# EAGLE design atmega16m1-breakout (EAGLE 8.3.2)
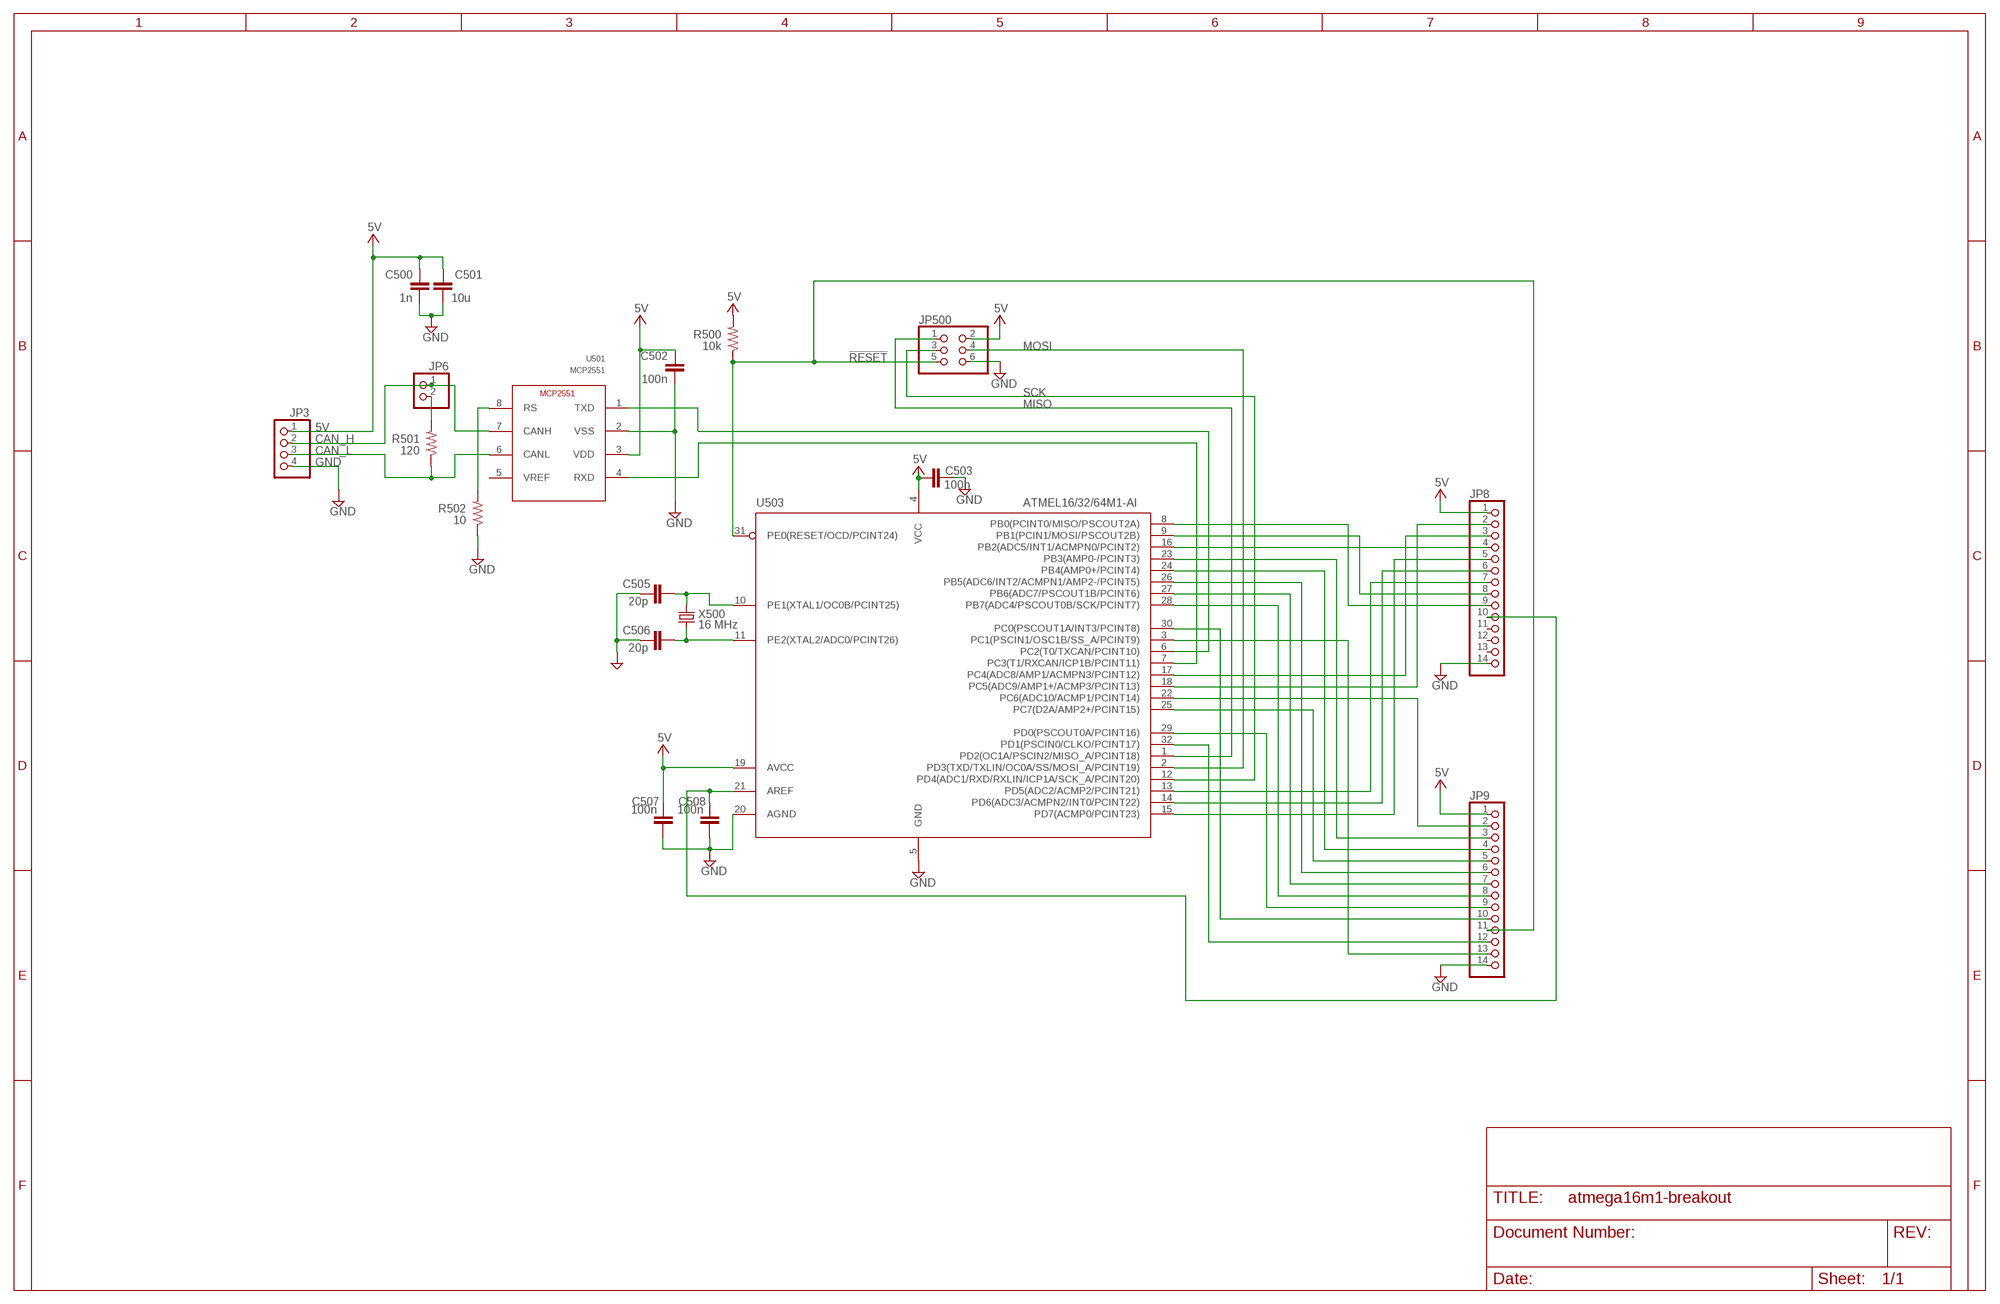
[diagram p0: schematic, sheet 1]
FRAME1 (FRAME_B_L): REV: 3

## Parts
C500  1n  C-EU0603-B-NOSILK  [0603-B-NOSILK]
C501  10u  C-EU0805-B-NOSILK  [0805-B-NOSILK]
C502  100n  C-EU0603-B-NOSILK  [0603-B-NOSILK]
C503  100n  C-EU0603-B-NOSILK  [0603-B-NOSILK]
C505  20p  C-EU0603-B-NOSILK  [0603-B-NOSILK]
C506  20p  C-EU0603-B-NOSILK  [0603-B-NOSILK]
C507  100n  C-EU0603-B-NOSILK  [0603-B-NOSILK]
C508  100n  C-EU0603-B-NOSILK  [0603-B-NOSILK]
JP3  PINHD-1X4  [1X04]
JP6  PINHD-1X2  [1X02]
JP8  PINHD-1X14  [1X14]
JP9  PINHD-1X14  [1X14]
JP500  PINHD-2X3  [2X03]
R500  10k  R-US_0603-B-NOSILK  [0603-B-NOSILK]
R501  120  R-US_0603-B-NOSILK  [0603-B-NOSILK]
R502  10  R-US_0603-B-NOSILK  [0603-B-NOSILK]
U501  MCP2551  [SO08]
U503  ATMEL16/32/64M1-AI  ATMEL16/32/64M1-AZ  [TQFP32-08]
X500  16 MHz  CRYSTALABM3  [ABM3]

## Nets
5V: C500.1 C501.1 C502.1 C503.2 C507.1 JP3.1 JP8.1 JP9.1 JP500.2 R500.2 U501.3(VDD) U503.4(VCC) U503.19(AVCC)
!RESET: JP9.11 JP500.5 R500.1 U503.31(PE0(RESET/OCD/PCINT24))
AREF: C508.1 JP8.10 U503.21(AREF)
CAN_H: JP3.2 JP6.1 U501.7(CANH)
CAN_L: JP3.3 R501.1 U501.6(CANL)
GND: C500.2 C501.2 C502.2 C503.1 C505.2 C506.2 C507.2 C508.2 JP3.4 JP8.14 JP9.14 JP500.6 R502.1 U501.2(VSS) U503.5(GND) U503.20(AGND)
MISO: JP500.1 U503.1(PD2(OC1A/PSCIN2/MISO_A/PCINT18))
MOSI: JP500.4 U503.2(PD3(TXD/TXLIN/OC0A/SS/MOSI_A/PCINT19))
N$3: JP6.2 R501.2
N$10: R502.2 U501.8(RS)
PB0: JP8.9 U503.8(PB0(PCINT0/MISO/PSCOUT2A))
PB1: JP8.8 U503.9(PB1(PCIN1/MOSI/PSCOUT2B))
PB2: JP8.4 U503.16(PB2(ADC5/INT1/ACMPN0/PCINT2))
PB3: JP9.3 U503.23(PB3(AMP0-/PCINT3))
PB4: JP9.4 U503.24(PB4(AMP0+/PCINT4))
PB5: JP9.6 U503.26(PB5(ADC6/INT2/ACMPN1/AMP2-/PCINT5))
PB6: JP9.7 U503.27(PB6(ADC7/PSCOUT1B/PCINT6))
PB7: JP9.8 U503.28(PB7(ADC4/PSCOUT0B/SCK/PCINT7))
PC0: JP9.10 U503.30(PC0(PSCOUT1A/INT3/PCINT8))
PC1: JP9.13 U503.3(PC1(PSCIN1/OSC1B/SS_A/PCINT9))
PC4: JP8.3 U503.17(PC4(ADC8/AMP1/ACMPN3/PCINT12))
PC5: JP8.2 U503.18(PC5(ADC9/AMP1+/ACMP3/PCINT13))
PC6: JP9.2 U503.22(PC6(ADC10/ACMP1/PCINT14))
PC7: JP9.5 U503.25(PC7(D2A/AMP2+/PCINT15))
PD0: JP9.9 U503.29(PD0(PSCOUT0A/PCINT16))
PD1: JP9.12 U503.32(PD1(PSCIN0/CLKO/PCINT17))
PD5: JP8.7 U503.13(PD5(ADC2/ACMP2/PCINT21))
PD6: JP8.6 U503.14(PD6(ADC3/ACMPN2/INT0/PCINT22))
PD7: JP8.5 U503.15(PD7(ACMP0/PCINT23))
PE2: C506.1 U503.11(PE2(XTAL2/ADC0/PCINT26)) X500.P1
PE3: C505.1 U503.10(PE1(XTAL1/OC0B/PCINT25)) X500.P2
RXCAN: U501.4(RXD) U503.7(PC3(T1/RXCAN/ICP1B/PCINT11))
SCK: JP500.3 U503.12(PD4(ADC1/RXD/RXLIN/ICP1A/SCK_A/PCINT20))
TXCAN: U501.1(TXD) U503.6(PC2(T0/TXCAN/PCINT10))
Unconnected: JP8.11 JP8.12 JP8.13 U501.5(VREF)

## Library data of the parts
C500-C503 C505-C508 = rcl_custom:C-EU: CAPACITOR, European symbol
JP3 = pinhead:PINHD-1X4: PIN HEADER
JP6 = pinhead:PINHD-1X2: PIN HEADER
JP8 JP9 = pinhead:PINHD-1X14: PIN HEADER
JP500 = pinhead:PINHD-2X3: PIN HEADER
R500-R502 = rcl_custom:R-US_: RESISTOR, American symbol
U501 = Tova:MCP2551
U503 = Tova:ATMEL16/32/64M1: MICROCONTROLLER 8 Kbytes FLASH, 1 kbytes SRAM, 512 bytes EEPROM, USART, 6-channel 10 bit ADC, 2-channel 8 bit ADC Pin compatible with Atmega48, ATMega88, ATMega168 Source: avr.lbr; MPN: ATMEGA8-16AU; OC_FARNELL: 9171371; OC_NEWARK: 73M8863
X500 = Tova:CRYSTAL: Crystals Various standard crystals. Proven footprints. Spark Fun Electronics SKU : COM-00534

## Board
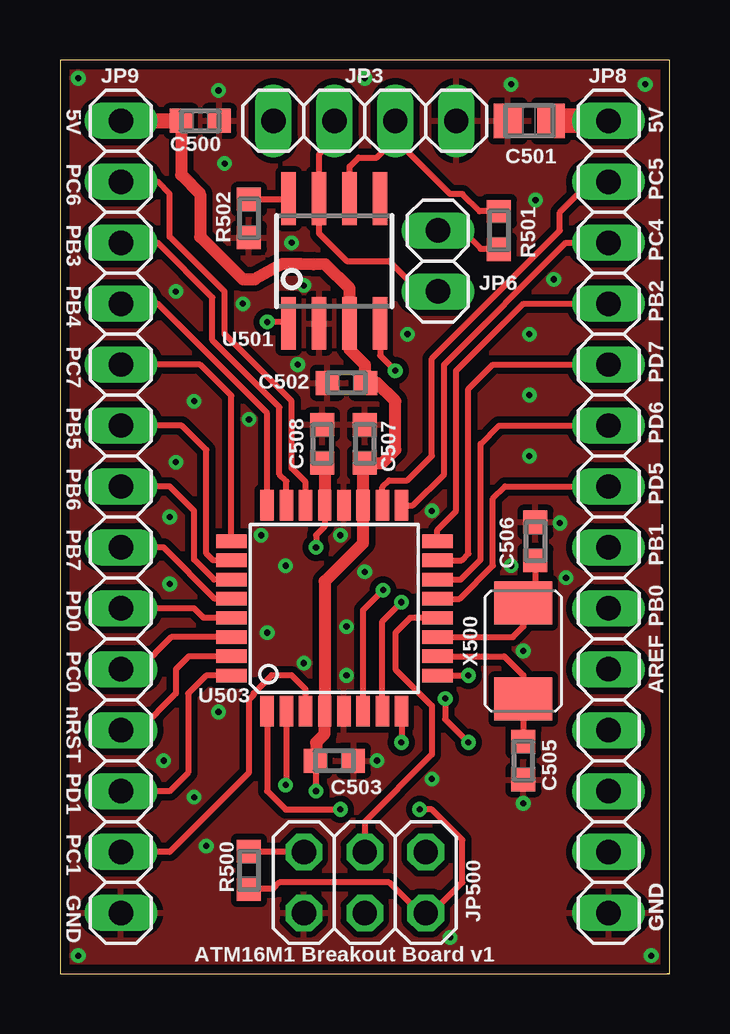
[diagram p1: board, top side]
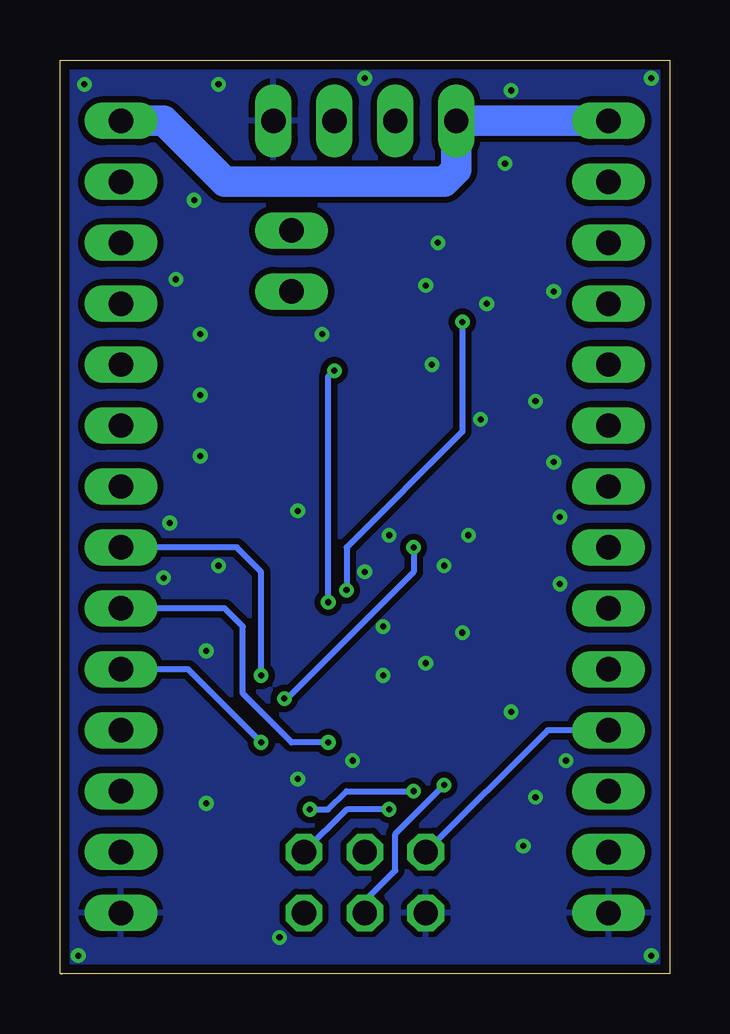
[diagram p2: board, bottom side, seen from below]

Size 25.4 x 38.1 mm. Coordinates in mm from the lower left corner, seen from the top.
Outline: 0,0 25.38,0 25.3,0 25.4,0 25.4,38.1 0,38.1 0,0
Copper layers (1*16): Top 0.0356mm / dielectric 1.5011mm / Bottom 0.0356mm
Design rules "OSH-Park-2-layer *": minimum track width 6mil, minimum drill 10mil, track to track 6mil, track to pad 6mil, pad to pad 6mil, via to via 6mil, smd to smd 6mil, copper to edge 15mil, drill to drill 6mil, minimum pad ring 7mil, minimum via ring 7mil, stop-mask expansion 3mil, vias tented up to drill 10mil, thermal gap 10mil

### Footprints (pad centres in the part's own frame; a part is rotated, then mirrored left to right if it is on the bottom)
0603-B-NOSILK = smd 0.95 x 1: 1 -0.8,0; 2 0.8,0
0805-B-NOSILK = smd 1.15 x 1.45: 1 -0.9,0; 2 0.9,0
1X04 = drill 1.016 long: 1 -3.81,0; 2 -1.27,0; 3 1.27,0; 4 3.81,0
1X02 = drill 1.016 long: 1 -1.27,0; 2 1.27,0
1X14 = drill 1.016 long: 1 -16.51,0; 2 -13.97,0; 3 -11.43,0; 4 -8.89,0; 5 -6.35,0; 6 -3.81,0; 7 -1.27,0; 8 1.27,0; 9 3.81,0; 10 6.35,0; 11 8.89,0; 12 11.43,0; 13 13.97,0; 14 16.51,0
2X03 = drill 1.016 octagon: 1 -2.54,-1.27; 2 -2.54,1.27; 3 0,-1.27; 4 0,1.27; 5 2.54,-1.27; 6 2.54,1.27
SO08 = smd 0.6 x 2.2: 1 -1.905,-2.6; 2 -0.635,-2.6; 3 0.635,-2.6; 4 1.905,-2.6; 5 1.905,2.6; 6 0.635,2.6; 7 -0.635,2.6; 8 -1.905,2.6
TQFP32-08 = smd 1.27 x 0.559: 1 -4.293,2.8; 2 -4.293,2; 3 -4.293,1.2; 4 -4.293,0.4; 5 -4.293,-0.4; 6 -4.293,-1.2; 7 -4.293,-2; 8 -4.293,-2.8; 17 4.293,-2.8; 18 4.293,-2; 19 4.293,-1.2; 20 4.293,-0.4; 21 4.293,0.4; 22 4.293,1.2; 23 4.293,2; 24 4.293,2.8 | smd 0.559 x 1.27: 9 -2.8,-4.293; 10 -2,-4.293; 11 -1.2,-4.293; 12 -0.4,-4.293; 13 0.4,-4.293; 14 1.2,-4.293; 15 2,-4.293; 16 2.8,-4.293; 25 2.8,4.293; 26 2,4.293; 27 1.2,4.293; 28 0.4,4.293; 29 -0.4,4.293; 30 -1.2,4.293; 31 -2,4.293; 32 -2.8,4.293
ABM3 = smd 1.8 x 2.4: P1 -2,0; P2 2,0

### Placement (x,y rotation side)
C500  5.84,35.56 0 top
C501  19.56,35.56 180 top
C502  11.94,24.64 180 top
C503  11.43,8.89 180 top
C505  19.3,8.89 270 top
C506  19.81,18.03 90 top
C507  12.7,22.1 90 top
C508  10.92,22.1 90 top
JP3  12.7,35.56 0 top
JP6  15.75,29.72 90 top
JP8  22.86,19.05 270 top
JP9  2.54,19.05 270 top
JP500  12.7,3.81 180 top
R500  7.87,4.32 270 top
R501  18.29,30.99 270 top
R502  7.87,31.5 90 top
U501  11.43,29.72 0 top
U503  11.43,15.24 90 top
X500  19.3,13.46 270 top

### Tracks (layer width: path | path; a pad name or v marks a point on that pad's centre or on a via)
5V  (via drill 0.25)
  Top 0.254: R500.2 7.91,3.56 8.89,3.56 9.14,3.81 13.72,3.81 14.99,2.54 JP500.2 15.49,2.54 16.76,3.81 16.76,5.59 15.49,6.86 v14.99,6.86 | v10.67,7.62 10.67,8.85 C503.2
  Top 0.508: C503.2 10.67,8.93 10.67,9.65 11.03,10.01 U503.4 11.03,16.36 12.63,17.96 U503.19 12.63,21.48 C507.1 13.42,21.3 13.97,21.84 13.97,23.88 13.21,24.64 C502.1 12.7,24.93 12.7,25.4 12.06,26.04 U501.3 12.06,28.57 11.06,29.58 10.55,29.58 10.03,29.6 9.28,29.6 8.12,28.96 7.62,28.96 5.84,30.73 5.84,32.51 5.04,33.31 C500.1
  Top 0.635: JP9.1 C500.1
  Top 1.016: C501.1 JP8.1
  Bottom 0.254: v14.99,6.86 14.22,6.86 13.46,7.62 v10.67,7.62
  Bottom 1.27: JP9.1 JP3.1 8.89,33.53 9.4,33.02 18.54,33.02 21.08,35.56 JP8.1
!RESET
  Top 0.254: JP500.5 7.91,5.08 R500.1 | U503.31 5.37,13.24 4.83,12.7 4.83,11.68 3.3,10.16 JP9.11
  Bottom 0.254: JP9.11 5.08,10.16 JP500.5
AREF  (via drill 0.25)
  Top 0.254: U503.21 11.03,18.65 10.67,18.29 v10.67,17.78 | v16.05,11.48 16.05,10.62 v17.02,9.65
  Top 0.508: U503.21 11.03,21.44 C508.1
  Bottom 0.254: v10.67,17.78 10.67,16.76 16,11.43 v16.05,11.48 | v17.02,9.65 20.07,12.7 JP8.10
CAN_H
  Top 0.254: JP6.1 14.99,28.45 13.72,29.72 11.94,29.72 10.79,30.86 U501.7 10.79,34.16 11.43,34.8 JP3.2
CAN_L
  Top 0.254: R501.1 17.49,31.79 16.76,32.51 16.26,32.51 13.97,34.8 | 13.97,34.8 JP3.3 | U501.6 12.06,33.66 12.45,34.04 13.21,34.04 13.97,34.8
GND  (via drill 0.25)
  other vias: 13.21,8.89 9.4,17.02 19.3,7.11 20.83,18.8 19.3,13.46 6.86,33.78 9.65,30.48 9.91,25.4 7.62,27.94 4.83,28.45 5.59,23.88 14.48,26.67 19.81,32.26 19.56,21.59 19.56,24.13 19.56,26.67 20.57,28.96 6.6,36.83 10.16,28.7 11.68,18.29 7.87,23.11 8.38,18.29 10.16,12.95 11.94,12.45 11.94,14.48 12.7,16.76 15.49,19.3 6.6,10.92 5.59,7.37 4.32,8.89 6.1,5.33 18.8,37.08 24.38,37.08 12.7,37.34 0.76,37.34 4.83,21.34 4.57,19.05 4.57,16.26 8.64,14.22 0.76,0.76 24.64,0.76 21.08,16.51 18.8,17.02 15.49,8.13 16.26,1.52
  pour Bottom (isolate 0.254, rank 3): 0,38.1 25.4,38.1 25.4,0 0,0
  pour Top (isolate 0.254, rank 3): 25.4,38.1 25.4,0 0,0 0,38.1
MISO  (via drill 0.25)
  Top 0.254: U503.1 8.63,7.63 9.4,6.86 v11.68,6.86
  Bottom 0.254: v11.68,6.86 13.46,6.86 JP500.1
MOSI  (via drill 0.25)
  Top 0.254: U503.2 9.43,7.91 v9.4,7.87
  Bottom 0.254: JP500.4 12.7,3.05 11.43,4.32 11.43,5.84 v9.4,7.87
N$3
  Top 0.254: JP6.2 16.76,30.99 17.53,30.23 18.33,30.23 | 18.54,30.23 18.33,30.23 | 18.33,30.23 R501.2
N$10
  Top 0.254: R502.2 9.5,32.3 U501.8
PB0  (via drill 0.25)
  Top 0.254: U503.8 v14.23,9.66 v14.22,9.65
  Bottom 0.254: v14.22,9.65 15.75,9.65 17.78,11.68 17.78,14.48 18.54,15.24 JP8.9
PB1  (via drill 0.25)
  Top 0.254: U503.9 v17.01,12.44 v17.02,12.45
  Bottom 0.254: v17.02,12.45 17.02,16.76 18.03,17.78 JP8.8
PB2
  Top 0.254: JP8.4 19.3,27.94 16.51,25.15 16.51,19.3 15.72,18.52 U503.16
PB3
  Top 0.254: U503.23 9.43,20.54 9.14,20.83 9.14,23.62 6.35,26.42 6.35,28.19 4.06,30.48 JP9.3
PB4
  Top 0.254: U503.24 8.63,23.37 4.06,27.94 JP9.4
PB5
  Top 0.254: U503.26 6.38,17.24 6.1,17.53 6.1,21.84 5.08,22.86 JP9.6
PB6
  Top 0.254: U503.27 6.42,16.44 5.59,17.27 5.59,19.3 4.57,20.32 JP9.7
PB7
  Top 0.254: U503.28 6.46,15.64 4.32,17.78 JP9.8
PC0
  Top 0.254: U503.30 4.64,14.04 3.3,12.7 JP9.10
PC1
  Top 0.254: U503.3 10.23,11.87 9.65,12.45 8.82,12.45 8.07,11.7 8.07,11.63 7.87,11.43 7.87,8.38 4.57,5.08 JP9.13
PC4
  Top 0.254: U503.17 14.71,19.53 16,20.83 16,25.4 21.08,30.48 JP8.3
PC5
  Top 0.254: U503.18 13.43,20.29 13.72,20.57 14.48,20.57 15.49,21.59 15.49,25.65 20.83,30.99 20.83,31.75 22.1,33.02 JP8.2
PC6
  Top 0.254: U503.22 10.23,20.5 9.65,21.08 9.65,23.88 6.86,26.67 6.86,28.45 4.57,30.73 4.57,32.51 4.06,33.02 JP9.2
PC7
  Top 0.254: U503.25 7.14,24.11 5.84,25.4 JP9.5
PD0
  Top 0.254: U503.29 5.99,14.84 5.59,15.24 JP9.9
PD1
  Top 0.254: U503.32 6.09,12.44 5.33,11.68 5.33,8.38 4.57,7.62 JP9.12
PD5
  Top 0.254: U503.13 16.66,15.64 18.03,17.02 18.03,19.81 18.54,20.32 JP8.7
PD6
  Top 0.254: U503.14 16.69,16.44 17.53,17.27 17.53,22.1 18.29,22.86 JP8.6
PD7
  Top 0.254: U503.15 16.73,17.24 17.02,17.53 17.02,24.38 18.03,25.4 JP8.5
PE2
  Top 0.254: U503.11 18.87,14.04 19.3,14.48 X500.P1 19.81,15.97 C506.1
PE3
  Top 0.254: U503.10 18.51,13.24 19.3,12.45 X500.P2 C505.1
RXCAN  (via drill 0.25)
  Top 0.254: U503.7 13.43,14.7 v14.22,15.49 | 13.34,26.54 U501.4 13.34,25.78 v13.97,25.15
  Bottom 0.254: v14.22,15.49 14.22,24.89 v13.97,25.15
SCK
  Top 0.254: U503.12 14.59,14.84 13.97,14.22 13.97,12.7 15.49,11.18 15.49,9.14 12.7,6.35 JP500.3
TXCAN  (via drill 0.25)
  Top 0.254: U503.6 12.63,15.17 v13.46,16 | U501.1 9.4,27.18 v8.64,27.18
  Bottom 0.254: v13.46,16 13.46,17.78 8.64,22.61 v8.64,27.18

### Text on the board
tPlace: 5V | 5V | PC6 | PC5 | PB3 | PC4 | PB4 | PB2 | PC7 | PD7 | PB5 | PD6 | PB6 | PD5 | PB7 | PB1 | PD0 | PB0 | PC0 | AREF | nRST | PD1 | PC1 | GND | GND | GND | ATM16M1 Breakout Board v1